# Altium schematic sheet [1]PowerSupply.SchDoc
size A4
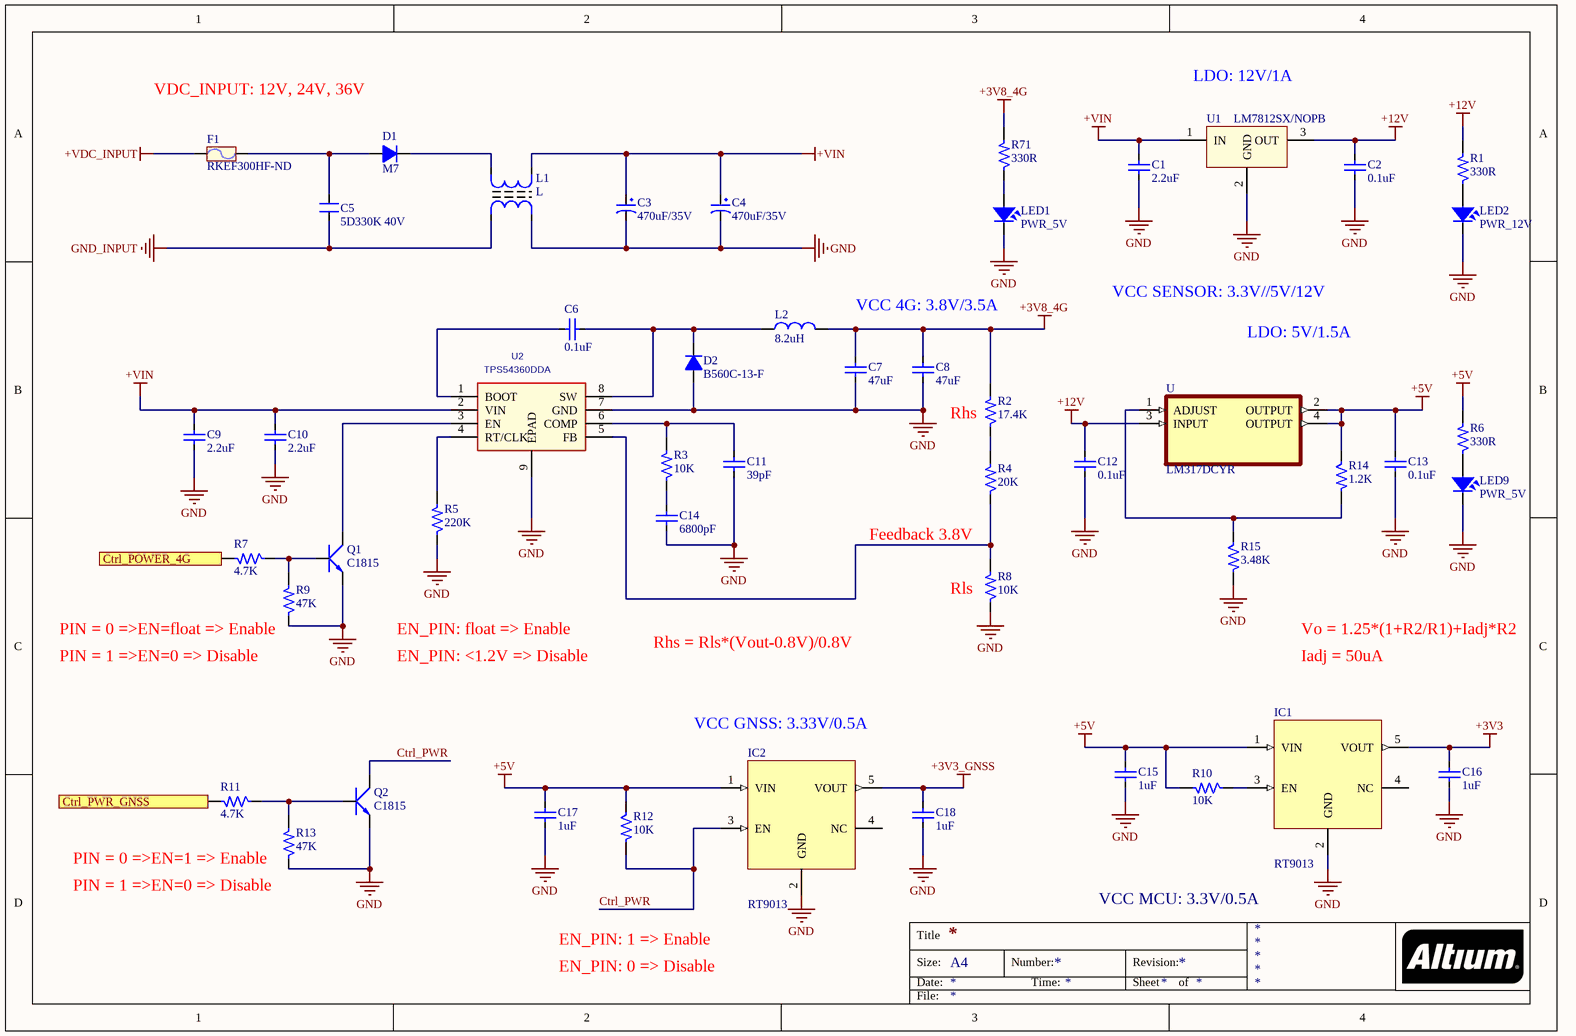
[diagram p0: [1]PowerSupply.SchDoc]

## Parts
C1  2.2uF  [CAP_0805]
C2  0.1uF  [CAP_0805]
C3  470uF/35V  [C10mm]
C4  470uF/35V  [C10mm]
C5  5D330K 40V  [CN2]
C6  0.1uF  [CAP_0805]
C7  47uF  [CAP_0805]
C8  47uF  [CAP_0805]
C9  2.2uF  [CAP_0805]
C10  2.2uF  [CAP_0805]
C11  39pF  [CAP_0805]
C12  0.1uF  [CAP_0805]
C13  0.1uF  [CAP_0805]
C14  6800pF  [CAP_0805]
C15  1uF  [CAP_0805]
C16  1uF  [CAP_0805]
C17  1uF  [CAP_0805]
C18  1uF  [CAP_0805]
D1  M7  [SMA11]
D2  B560C-13-F  [DO-214AB SMC]
F1  RKEF300HF-ND  [FUSE2]
IC1  RT9013  [SOT23-5]
IC2  RT9013  [SOT23-5]
L1  L  [L2 UF9.8]
L2  8.2uH  [L01 SMD 12*12*6]
LED1  PWR_5V  [LED-0805-Blue]
LED2  PWR_12V  [LED-0805-Blue]
LED9  PWR_5V  [LED-0805-Blue]
Q1  C1815  [SOT23B]
Q2  C1815  [SOT23B]
R1  330R  [R0805]
R2  17.4K  [R0805]
R3  10K  [R0805]
R4  20K  [R0805]
R5  220K  [R0805]
R6  330R  [R0805]
R7  4.7K  [R0805]
R8  10K  [R0805]
R9  47K  [R0805]
R10  10K  [R0805]
R11  4.7K  [R0805]
R12  10K  [R0805]
R13  47K  [R0805]
R14  1.2K  [R0805]
R15  3.48K  [R0805]
R71  330R  [R0805]
U  LM317DCYR  [SOT230P700X180-4N]
U1  LM7812SX/NOPB  [QTO-220]
U2  TPS54360DDA  [DDA8_3P1X2P4-M]

## Ports
Ctrl_POWER_4G, Ctrl_PWR_GNSS

## Nets
+3V3: C16.2 IC1.5(VOUT)
+3V3_GNSS: C18.2 IC2.5(VOUT)
+3V8_4G: C7.2 C8.2 L2.2 R2.2 R71.2
+5V: C13.2 C15.2 C17.2 IC1.1(VIN) IC2.1(VIN) R6.2 R10.2 R12.1 R14.1 U.2(OUTPUT) U.4(OUTPUT)
+12V: C2.2 C12.2 R1.2 U.3(INPUT) U1.3(OUT)
+VDC_INPUT: F1.1
+VIN: C1.2 C3.1 C4.1 C9.2 C10.2 L1.3 U1.1(IN) U2.2(VIN)
GND: C1.1 C2.1 C3.2 C4.2 C7.1 C8.1 C9.1 C10.1 C11.1 C12.1 C13.1 C14.1 C15.1 C16.1 C17.1 C18.1 D2.1(A) IC1.2(GND) IC2.2(GND) L1.2 LED1.2 LED2.2 LED9.2 Q1.1(E) Q2.1(E) R5.1 R8.1 R9.1 R13.1 R15.2 U1.2(GND) U2.7(GND) U2.9(EPAD)
GND_INPUT: C5.1 L1.1
Ctrl_POWER_4G: R7.2 ; port Ctrl_POWER_4G
Ctrl_PWR: IC2.3(EN) Q2.2(C) R12.2
Ctrl_PWR_GNSS: R11.2 ; port Ctrl_PWR_GNSS
NetC5_2: C5.2 D1.1(A) F1.2
NetC6_1: C6.1 D2.2(K) L2.1 U2.8(SW)
NetC6_2: C6.2 U2.1(BOOT)
NetC11_2: C11.2 R3.2 U2.6(COMP)
NetC14_2: C14.2 R3.1
NetD1_2: D1.2(K) L1.4
NetIC1_3: IC1.3(EN) R10.1
NetLED1_1: LED1.1 R71.1
NetLED2_1: LED2.1 R1.1
NetLED9_1: LED9.1 R6.1
NetQ1_2: Q1.2(C) U2.3(EN)
NetQ1_3: Q1.3(B) R7.1 R9.2
NetQ2_3: Q2.3(B) R11.1 R13.2
NetR2_1: R2.1 R4.2
NetR4_1: R4.1 R8.2 U2.5(FB)
NetR5_2: R5.2 U2.4(RT/CLK)
NetR14_2: R14.2 R15.1 U.1(ADJUST)

Not connected (* = marked no-connect by the designer): IC1 4(NC); IC2 4(NC)

## Notes on the sheet
- VDC_INPUT: 12V, 24V, 36V
- LDO: 12V/1A
- VCC 4G: 3.8V/3.5A
- VCC SENSOR: 3.3V//5V/12V
- LDO: 5V/1.5A
- (near R2) Rhs
- Feedback 3.8V
- (near R9) PIN = 0 =>EN=float => Enable
- EN_PIN: float => Enable
- Rhs = Rls*(Vout-0.8V)/0.8V
- (near R8) Rls
- Vo = 1.25*(1+R2/R1)+Iadj*R2
- (near R9) PIN = 1 =>EN=0 => Disable
- EN_PIN: <1.2V => Disable
- Iadj = 50uA
- VCC GNSS: 3.33V/0.5A
- (near R13) PIN = 1 =>EN=0 => Disable
- (near R13) PIN = 0 =>EN=1 => Enable
- VCC MCU: 3.3V/0.5A
- EN_PIN: 1 => Enable
- EN_PIN: 0 => Disable
- Title
- Size:
- Date:
- A4
- Number:
- Time:
- Revision:
- Sheet
- of
- File:

## Library data of the parts
C1 C2 C6-C18 = CapSMD: Capacitor; Value: 33p; Published: 8-Jun-2000; LatestRevisionDate: 17-Jul-2002; LatestRevisionNote: Re-released for DXP Platform.; PackageReference: RAD-0.3; Publisher: Altium Limited
C3 C4 = CP4: Cap 1000uF/16V - 220uF/50V; Description 5: 4,7uF>10uF/250V_3,3uF>10uF/400V - 2,2uF>4,7uF/450V; Description 1: 2200uF-3300uF/6,3V - 1000uF-2200uF/10V; Description 2: 1000uF/16V - 470uF => 1000uF/25V - 100uF/100V; Description 3: 330uF>470uF/35V_220uF>470uF/50V_10uF>22uF/250V; Description 4: 220uF => 330uF/63V - 10uF =>33uF/160 - 200V; Value: 1000uF/16V
C5 = CN: 5D330K 33V; Value: 0,1uF/300V; Designed by: VanDungEvn
D1 = D1A: Diode 1A; Value: 1N4007
D2 = D5A: DIODE SCHOTTKY 60V 5A SMC; Value: 1N5408
F1 = Fuse: PTC RESET FUSE 60V 3A RADIAL; Designed by: VanDungEvn; Value: Fuse
IC1 IC2 = RT9013: RT9013-33GB IC REG LINEAR 3.3V 500mA SOT23-5
L1 = L2x220: Inductor; Value: Loc 220; Designed by: VanDungEvn
L2 = L1: FIXED IND 6.2UH 5.7A 22.4 MOHM; Value: 150 mH
LED1 LED2 LED9 = LED: LED Single colour Green and Red; Value: LED 3 ly Single Colour
Q1 Q2 = C1815: NPN 600mW, ECB; Value: C1815
R1-R15 R71 = RM: Resistor SMD; Value: 1K
U = LM317DCYR: 1.5-A, 40-V, adjustable linear voltage regulator 4-SOT-223 0 to 125; MF: Texas Instruments; Texas_Instruments-Purchase-URL: https://snapeda.com/shop?store=Texas+Instruments&id=215192; SnapEDA_Link: https://www.snapeda.com/parts/LM317DCYR/Texas%20Instruments/view-part/215192/?ref=snap; Availability: Unavailable; DigiKey-Purchase-URL: https://snapeda.com/shop?store=DigiKey&id=215192; Package: SOT-223-4 Texas Instruments; Value: *; Price: None; Mouser-Purchase-URL: https://snapeda.com/shop?store=Mouser&id=215192; MP: LM317DCYR
U1 = LM78xx_1: Value: LM7805
U2 = TPS54360DDA: REG BUCK SPLIT RAIL 8SOPWRPAD; C: Copyright (C) 2015 Accelerated Designs. All rights reserved; Vendor: TEXAS INSTRUMENTS; Built_By: EMA_UL_Team; Value: TPS54360DDA; Manufacturer_Part_Number: TPS54360DDA